# EAGLE design adapter (EAGLE 6.5.0)
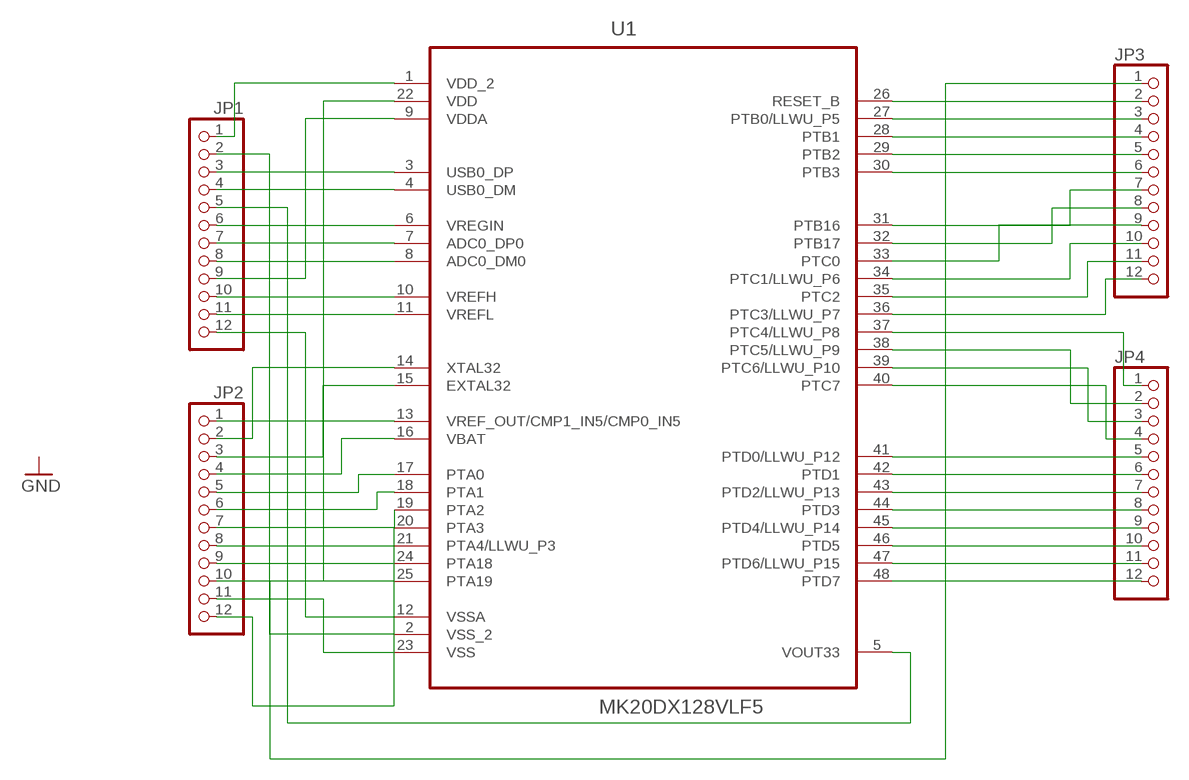
[diagram p0: schematic, sheet 1]

## Parts
JP1  PINHD-1X12-CB  [1X12-CB]
JP2  PINHD-1X12-CB  [1X12-CB]
JP3  PINHD-1X12-CB  [1X12-CB]
JP4  PINHD-1X12-CB  [1X12-CB]
U1  MK20DX128VLF5  [QFP50P900X900X160-48N]

## Nets
N$1: JP1.1 U1.1(VDD_2)
N$2: JP1.2 U1.2(VSS_2)
N$3: JP1.3 U1.3(USB0_DP)
N$4: JP1.4 U1.4(USB0_DM)
N$5: JP1.5 U1.5(VOUT33)
N$6: JP1.6 U1.6(VREGIN)
N$7: JP1.7 U1.7(ADC0_DP0)
N$8: JP1.8 U1.8(ADC0_DM0)
N$9: JP1.9 U1.9(VDDA)
N$10: JP1.10 U1.10(VREFH)
N$11: JP1.11 U1.11(VREFL)
N$12: JP1.12 U1.12(VSSA)
N$13: JP2.1 U1.13(VREF_OUT/CMP1_IN5/CMP0_IN5)
N$14: JP2.2 U1.14(XTAL32)
N$15: JP2.3 U1.15(EXTAL32)
N$16: JP2.4 U1.16(VBAT)
N$17: JP2.5 U1.17(PTA0)
N$18: JP2.6 U1.18(PTA1)
N$19: JP2.7 U1.19(PTA2)
N$20: JP2.8 U1.20(PTA3)
N$21: JP2.9 U1.21(PTA4/LLWU_P3)
N$22: JP2.10 U1.22(VDD)
N$23: JP2.11 U1.23(VSS)
N$24: JP2.12 U1.24(PTA18)
N$25: JP3.1 U1.25(PTA19)
N$26: JP3.2 U1.26(RESET_B)
N$27: JP3.3 U1.27(PTB0/LLWU_P5)
N$28: JP3.4 U1.28(PTB1)
N$29: JP3.5 U1.29(PTB2)
N$30: JP3.6 U1.30(PTB3)
N$31: JP3.7 U1.31(PTB16)
N$32: JP3.8 U1.32(PTB17)
N$33: JP3.9 U1.33(PTC0)
N$34: JP3.10 U1.34(PTC1/LLWU_P6)
N$35: JP3.11 U1.35(PTC2)
N$36: JP3.12 U1.36(PTC3/LLWU_P7)
N$37: JP4.5 U1.41(PTD0/LLWU_P12)
N$38: JP4.6 U1.42(PTD1)
N$39: JP4.7 U1.43(PTD2/LLWU_P13)
N$40: JP4.8 U1.44(PTD3)
N$41: JP4.9 U1.45(PTD4/LLWU_P14)
N$42: JP4.10 U1.46(PTD5)
N$43: JP4.11 U1.47(PTD6/LLWU_P15)
N$44: JP4.12 U1.48(PTD7)
N$45: JP4.4 U1.40(PTC7)
N$46: JP4.3 U1.39(PTC6/LLWU_P10)
N$47: JP4.2 U1.38(PTC5/LLWU_P9)
N$48: JP4.1 U1.37(PTC4/LLWU_P8)

## Library data of the parts
JP1-JP4 = adafruit:PINHD-1X12: PIN HEADER
U1 = MK20DX:MK20DX128VLF5: MCU, KINETIS, K20, CORTEX M4, 48LQFP; MPN: MK20DX128VLF5; OC_FARNELL: 2133571; OC_NEWARK: 89T6175; PACKAGE: 48LQFP; SUPPLIER: FREESCALE SEMICONDUCTOR

## Board
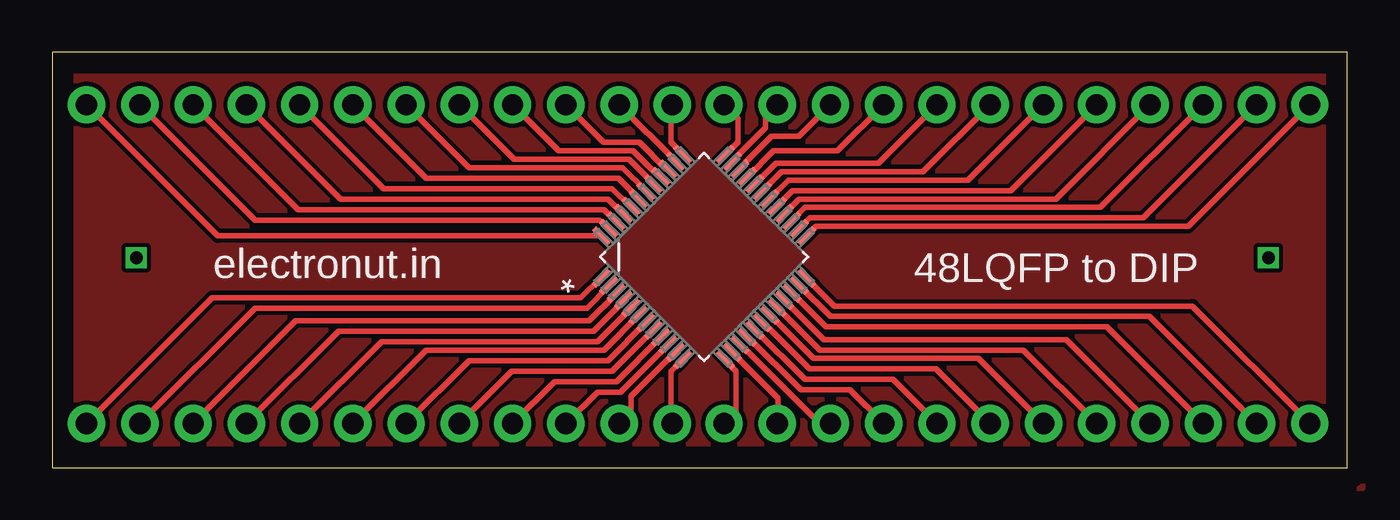
[diagram p1: board, top side]
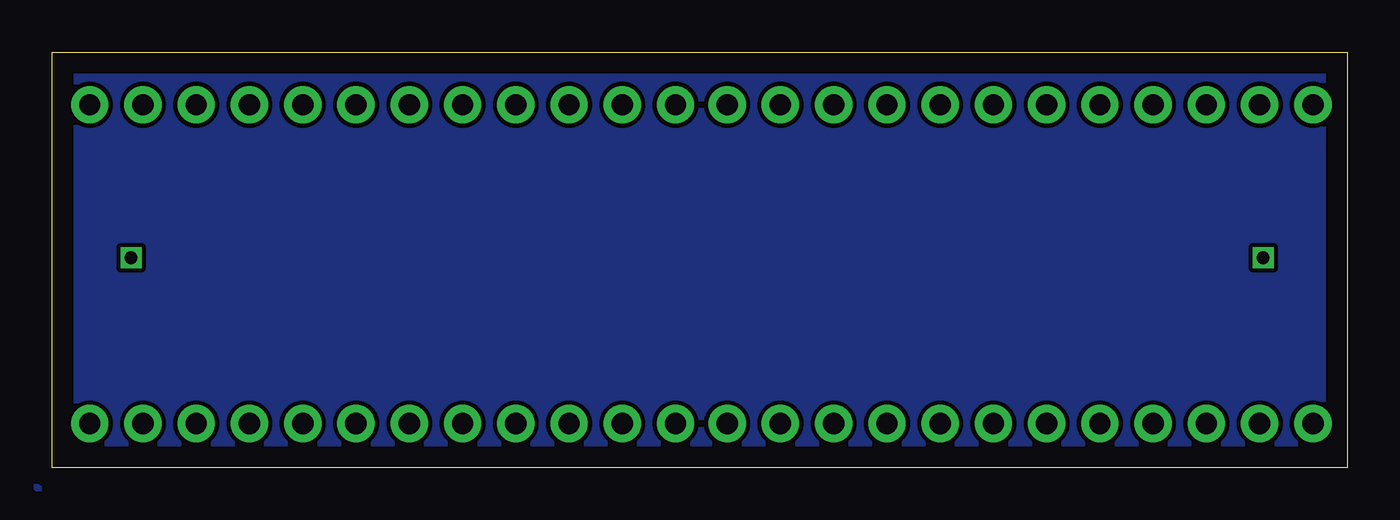
[diagram p2: board, bottom side, seen from below]

Size 61.75 x 19.79 mm. Coordinates in mm from the lower left corner, seen from the top.
Outline: 0,0 61.75,0 61.75,19.79 0,19.79 0,0
Copper layers (1*16): Top 0.035mm / dielectric 1.5mm / Bottom 0.035mm
Design rules "default": minimum track width 10mil, minimum drill 24mil, track to track 8mil, track to pad 8mil, pad to pad 8mil, via to via 8mil, smd to smd 8mil, copper to edge 40mil, drill to drill 8mil, minimum pad ring 10mil, minimum via ring 8mil, stop-mask expansion 4mil, vias tented up to drill 0mil, thermal gap 10mil

### Footprints (pad centres in the part's own frame; a part is rotated, then mirrored left to right if it is on the bottom)
1X12-CB = drill 1.016 pad 1.778: 1 -13.97,0; 2 -11.43,0; 3 -8.89,0; 4 -6.35,0; 5 -3.81,0; 6 -1.27,0; 7 1.27,0; 8 3.81,0; 9 6.35,0; 10 8.89,0; 11 11.43,0; 12 13.97,0
QFP50P900X900X160-48N = smd 1.041 x 0.279: 1 -4.166,2.743; 2 -4.166,2.261; 3 -4.166,1.753; 4 -4.166,1.245; 5 -4.166,0.762; 6 -4.166,0.254; 7 -4.166,-0.254; 8 -4.166,-0.762; 9 -4.166,-1.245; 10 -4.166,-1.753; 11 -4.166,-2.261; 12 -4.166,-2.743; 25 4.166,-2.743; 26 4.166,-2.261; 27 4.166,-1.753; 28 4.166,-1.245; 29 4.166,-0.762; 30 4.166,-0.254; 31 4.166,0.254; 32 4.166,0.762; 33 4.166,1.245; 34 4.166,1.753; 35 4.166,2.261; 36 4.166,2.743 | smd 0.279 x 1.041: 13 -2.743,-4.166; 14 -2.261,-4.166; 15 -1.753,-4.166; 16 -1.245,-4.166; 17 -0.762,-4.166; 18 -0.254,-4.166; 19 0.254,-4.166; 20 0.762,-4.166; 21 1.245,-4.166; 22 1.753,-4.166; 23 2.261,-4.166; 24 2.743,-4.166; 37 2.743,4.166; 38 2.261,4.166; 39 1.753,4.166; 40 1.245,4.166; 41 0.762,4.166; 42 0.254,4.166; 43 -0.254,4.166; 44 -0.762,4.166; 45 -1.245,4.166; 46 -1.753,4.166; 47 -2.261,4.166; 48 -2.743,4.166

### Placement (x,y rotation side)
JP1  15.6,2.1 0 top
JP2  46,2.1 0 top
JP3  46,17.3 180 top
JP4  15.6,17.3 180 top
U1  31.08,10.04 45 top

### Tracks (layer width: path | path; a pad name or v marks a point on that pad's centre or on a via)
GND
  pour Top: -0.5,20.5 -0.5,-1 62.5,-1 62.5,20.5
  pour Bottom: 0.5,20.5 -0.5,20.5 -0.5,-1 62.5,-1 62.5,20.5
N$1
  Top 0.254: U1.1 26.13,9.03 25.2,8.1 7.63,8.1 JP1.1
N$2
  Top 0.254: U1.2 26.54,8.64 25.5,7.6 9.67,7.6 JP1.2
N$3
  Top 0.254: U1.3 26.89,8.29 25.6,7 11.61,7 JP1.3
N$4
  Top 0.254: U1.4 27.25,7.95 25.8,6.5 13.65,6.5 JP1.4
N$5
  Top 0.254: U1.5 27.6,7.6 26,6 15.69,6 JP1.5
N$6
  Top 0.254: U1.6 27.95,7.25 26.3,5.6 17.83,5.6 JP1.6
N$7
  Top 0.254: U1.7 26.5,5.1 19.87,5.1 JP1.7
N$8
  Top 0.254: U1.8 28.66,6.56 26.7,4.6 21.91,4.6 JP1.8
N$9
  Top 0.254: U1.9 26.9,4.1 23.95,4.1 JP1.9
N$10
  Top 0.254: U1.10 29.36,5.86 27.1,3.6 25.99,3.6 JP1.10
N$11
  Top 0.254: U1.11 29.7,5.5 27.6,3.4 27.6,2.67 JP1.11
N$12
  Top 0.254: U1.12 30.05,5.16 29.5,4.6 29.5,2.17 JP1.12
N$13
  Top 0.254: U1.13 32.09,5.11 32.6,4.6 32.6,2.67 JP2.1
N$14
  Top 0.254: U1.14 32.43,5.47 34.6,3.3 34.6,2.13 JP2.2
N$15
  Top 0.254: U1.15 32.84,5.86 36.3,2.4 36.81,2.4 JP2.3
N$16
  Top 0.254: U1.16 33.19,6.21 35.7,3.7 38.05,3.7 JP2.4
N$17
  Top 0.254: U1.17 33.54,6.56 35.9,4.2 40.09,4.2 JP2.5
N$18
  Top 0.254: U1.18 33.88,6.92 36.1,4.7 42.13,4.7 JP2.6
N$19
  Top 0.254: U1.19 34.23,7.27 36.3,5.2 44.17,5.2 JP2.7
N$20
  Top 0.254: U1.20 36.6,5.6 46.31,5.6 JP2.8
N$21
  Top 0.254: U1.21 34.92,7.97 36.8,6.1 48.35,6.1 JP2.9
N$22
  Top 0.254: U1.22 36.9,6.7 50.29,6.7 JP2.10
N$23
  Top 0.254: U1.23 35.62,8.68 37.1,7.2 52.33,7.2 JP2.11
N$24
  Top 0.254: U1.24 37.3,7.7 54.37,7.7 JP2.12
N$25
  Top 0.254: JP3.1 54.17,11.5 36.42,11.5 U1.25
N$26
  Top 0.254: JP3.2 52.03,11.9 36.14,11.9 U1.26
N$27
  Top 0.254: U1.27 35.27,11.77 35.9,12.4 49.99,12.4 JP3.3
N$28
  Top 0.254: U1.28 35.6,12.8 47.85,12.8 JP3.4
N$29
  Top 0.254: U1.29 34.56,12.46 35.3,13.2 45.71,13.2 JP3.5
N$30
  Top 0.254: U1.30 35.1,13.7 43.67,13.7 JP3.6
N$31
  Top 0.254: JP3.7 41.53,14.1 34.78,14.1 U1.31
N$32
  Top 0.254: U1.32 33.52,13.52 34.5,14.5 39.39,14.5 JP3.8
N$33
  Top 0.254: U1.33 33.17,13.87 34.4,15.1 37.45,15.1 JP3.9
N$34
  Top 0.254: U1.34 32.79,14.29 34.3,15.8 35.61,15.8 JP3.10
N$35
  Top 0.254: U1.35 32.43,14.63 34,16.2 34,16.73 JP3.11
N$36
  Top 0.254: U1.36 32.12,14.93 32.7,15.5 32.7,16.63 JP3.12
N$37
  Top 0.254: U1.41 27.5,14.7 22.01,14.7 JP4.5
N$38
  Top 0.254: U1.42 28.31,13.19 27.2,14.3 19.87,14.3 JP4.6
N$39
  Top 0.254: U1.43 27.95,12.85 27,13.8 17.83,13.8 JP4.7
N$40
  Top 0.254: U1.44 27.55,12.45 26.7,13.3 15.79,13.3 JP4.8
N$41
  Top 0.254: U1.45 27.2,12.11 26.5,12.8 13.75,12.8 JP4.9
N$42
  Top 0.254: U1.46 26.85,11.75 26.3,12.3 11.71,12.3 JP4.10
N$43
  Top 0.254: U1.47 26.51,11.39 26.1,11.8 9.67,11.8 JP4.11
N$44
  Top 0.254: U1.48 7.88,11.05 JP4.12
N$45
  Top 0.254: U1.40 28.93,13.87 27.7,15.1 24.15,15.1 JP4.4
N$46
  Top 0.254: U1.39 29.27,14.22 28,15.5 26.29,15.5 JP4.3
N$47
  Top 0.254: U1.38 29.73,14.6 JP4.2
N$48
  Top 0.254: U1.37 29.5,15.5 29.5,17.23 JP4.1
N$49  (via drill 0.6)
  other vias: 4,10
N$50  (via drill 0.6)
  other vias: 58,10

### Text on the board
tNames: electronut.in | 48LQFP to DIP